# Altium schematic sheet MCU.SchDoc
size A4; SheetNumber: 5; SheetTotal: 9
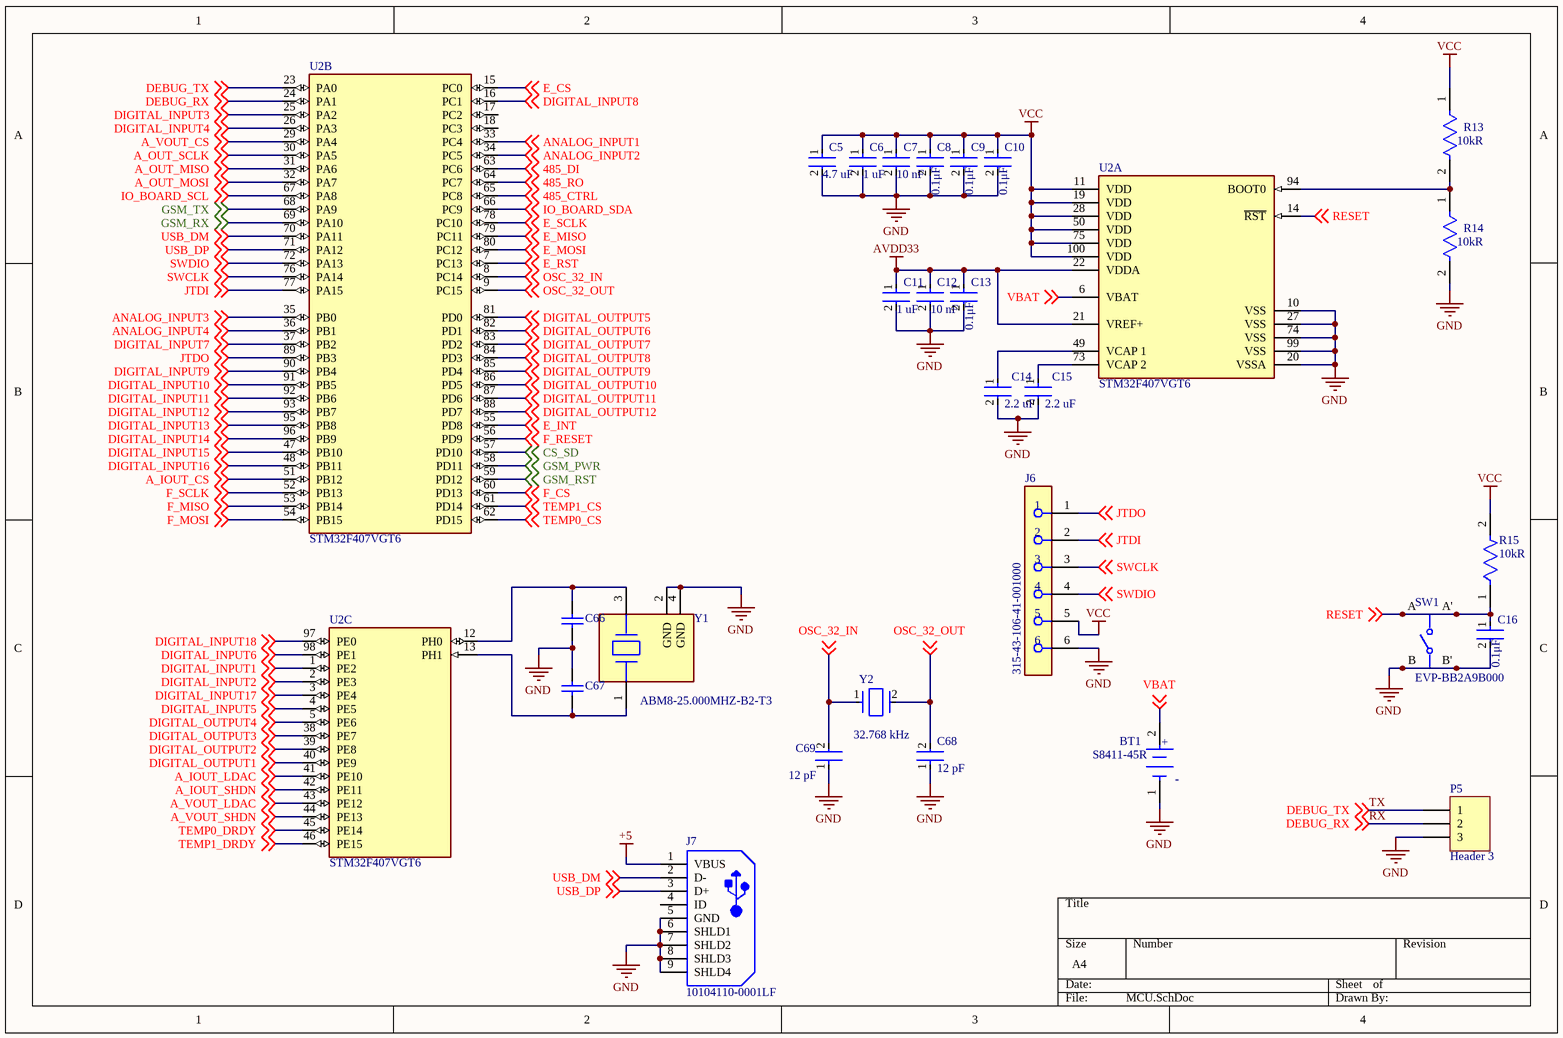
[diagram p0: MCU.SchDoc]

## Parts
BT1  S8411-45R  [FP-S8411-45R-MFG]
C5  value 4.7 uF  [FP-CC0603-DA-MFG]  (hidden comment: CC0603KRX5R8BB475)
C6  value 1 uF  [FP-CC0603-DA-MFG]  (hidden comment: CC0603KRX7R6BB105)
C7  value 10 nF  [FP-CC0603-DA-MFG]  (hidden comment: CC0603KRX7R6BB103)
C8  value 0.1μF  [FP-C0603C-CF-MFG]  (hidden comment: C0603C104K8PAC7867)
C9  value 0.1μF  [FP-C0603C-CF-MFG]  (hidden comment: C0603C104K8PAC7867)
C10  value 0.1μF  [FP-C0603C-CF-MFG]  (hidden comment: C0603C104K8PAC7867)
C11  value 1 uF  [FP-CC0603-DA-MFG]  (hidden comment: CC0603KRX7R6BB105)
C12  value 10 nF  [FP-CC0603-DA-MFG]  (hidden comment: CC0603KRX7R6BB103)
C13  value 0.1μF  [FP-C0603C-CF-MFG]  (hidden comment: C0603C104K8PAC7867)
C14  value 2.2 uF  [FP-CC0603-DA-MFG]  (hidden comment: CC0603KPX5R5BB225)
C15  value 2.2 uF  [FP-CC0603-DA-MFG]  (hidden comment: CC0603KPX5R5BB225)
C16  value 0.1μF  [FP-C0603C-CF-MFG]  (hidden comment: C0603C104K8PAC7867)
C66  VJ0603A180JXAAC  [CAPC1608X92X38ML15T08]  (value not drawn)
C67  VJ0603A180JXAAC  [CAPC1608X92X38ML15T08]  (value not drawn)
C68  value 12 pF  [FP-C0603C-CF-MFG]  (hidden comment: C0603C120C5GAC7867)
C69  value 12 pF  [FP-C0603C-CF-MFG]  (hidden comment: C0603C120C5GAC7867)
J6  315-43-106-41-001000  [FP-315-43-106-41-001000-MFG]
J7  10104110-0001LF  [FCI-10104110-0001LF_V]
P5  Header 3  [HDR1X3]
R13  Resistance: 10kR  [FP-CRCW0603-e3-IPC_A]  (hidden comment: CRCW060310K0FKED)
R14  Resistance: 10kR  [FP-CRCW0603-e3-IPC_A]  (hidden comment: CRCW060310K0FKED)
R15  Resistance: 10kR  [FP-CRCW0603-e3-IPC_A]  (hidden comment: CRCW060310K0FKED)
SW1  EVP-BB2A9B000  [FP-EVP-BB2A9B000-MFG]
U2  STM32F407VGT6  [FP-LQFP100-1L-IPC_A]  (parts A,B,C of 3)
Y1  ABM8-25.000MHZ-B2-T3  [FP-ABM8-MFG]
Y2  Operating Frequency: 32.768 kHz  [FP-ABS09-MFG]  (hidden comment: ABS09-32.768KHZ-1-T)

## Nets
+5: J7.1(VBUS)
AVDD33: C11.1 C12.1 C13.1 U2.21(VREF+) U2.22(VDDA)
GND: BT1.1(C) C5.2 C6.2 C7.2 C8.2 C9.2 C10.2 C11.2 C12.2 C13.2 C14.2 C15.2 C16.2 C66.2 C67.1 C68.1 C69.1 J6.6 J7.5(GND) J7.6(SHLD1) J7.7(SHLD2) J7.8(SHLD3) J7.9(SHLD4) P5.3 R14.2 SW1.B SW1.B' U2.10(VSS) U2.20(VSSA) U2.27(VSS) U2.74(VSS) U2.99(VSS) Y1.2(GND) Y1.4(GND)
VCC: C5.1 C6.1 C7.1 C8.1 C9.1 C10.1 J6.5 R13.1 R15.2 U2.11(VDD) U2.19(VDD) U2.28(VDD) U2.50(VDD) U2.75(VDD) U2.100(VDD)
485_CTRL: U2.65(PC8) ; off-sheet 485_CTRL
485_DI: U2.63(PC6) ; off-sheet 485_DI
485_RO: U2.64(PC7) ; off-sheet 485_RO
A_IOUT_CS: U2.51(PB12) ; off-sheet A_IOUT_CS
A_IOUT_LDAC: U2.41(PE10) ; off-sheet A_IOUT_LDAC
A_IOUT_SHDN: U2.42(PE11) ; off-sheet A_IOUT_SHDN
A_OUT_MISO: U2.31(PA6) ; off-sheet A_OUT_MISO
A_OUT_MOSI: U2.32(PA7) ; off-sheet A_OUT_MOSI
A_OUT_SCLK: U2.30(PA5) ; off-sheet A_OUT_SCLK
A_VOUT_CS: U2.29(PA4) ; off-sheet A_VOUT_CS
A_VOUT_LDAC: U2.43(PE12) ; off-sheet A_VOUT_LDAC
A_VOUT_SHDN: U2.44(PE13) ; off-sheet A_VOUT_SHDN
ANALOG_INPUT1: U2.33(PC4) ; off-sheet ANALOG_INPUT1
ANALOG_INPUT2: U2.34(PC5) ; off-sheet ANALOG_INPUT2
ANALOG_INPUT3: U2.35(PB0) ; off-sheet ANALOG_INPUT3
ANALOG_INPUT4: U2.36(PB1) ; off-sheet ANALOG_INPUT4
CS_SD: U2.57(PD10) ; off-sheet CS_SD
DIGITAL_INPUT1: U2.1(PE2) ; off-sheet DIGITAL_INPUT1
DIGITAL_INPUT2: U2.2(PE3) ; off-sheet DIGITAL_INPUT2
DIGITAL_INPUT3: U2.25(PA2) ; off-sheet DIGITAL_INPUT3
DIGITAL_INPUT4: U2.26(PA3) ; off-sheet DIGITAL_INPUT4
DIGITAL_INPUT5: U2.4(PE5) ; off-sheet DIGITAL_INPUT5
DIGITAL_INPUT6: U2.98(PE1) ; off-sheet DIGITAL_INPUT6
DIGITAL_INPUT7: U2.37(PB2) ; off-sheet DIGITAL_INPUT7
DIGITAL_INPUT8: U2.16(PC1) ; off-sheet DIGITAL_INPUT8
DIGITAL_INPUT9: U2.90(PB4) ; off-sheet DIGITAL_INPUT9
DIGITAL_INPUT10: U2.91(PB5) ; off-sheet DIGITAL_INPUT10
DIGITAL_INPUT11: U2.92(PB6) ; off-sheet DIGITAL_INPUT11
DIGITAL_INPUT12: U2.93(PB7) ; off-sheet DIGITAL_INPUT12
DIGITAL_INPUT13: U2.95(PB8) ; off-sheet DIGITAL_INPUT13
DIGITAL_INPUT14: U2.96(PB9) ; off-sheet DIGITAL_INPUT14
DIGITAL_INPUT15: U2.47(PB10) ; off-sheet DIGITAL_INPUT15
DIGITAL_INPUT16: U2.48(PB11) ; off-sheet DIGITAL_INPUT16
DIGITAL_INPUT17: U2.3(PE4) ; off-sheet DIGITAL_INPUT17
DIGITAL_INPUT18: U2.97(PE0) ; off-sheet DIGITAL_INPUT18
DIGITAL_OUTPUT1: U2.40(PE9) ; off-sheet DIGITAL_OUTPUT1
DIGITAL_OUTPUT2: U2.39(PE8) ; off-sheet DIGITAL_OUTPUT2
DIGITAL_OUTPUT3: U2.38(PE7) ; off-sheet DIGITAL_OUTPUT3
DIGITAL_OUTPUT4: U2.5(PE6) ; off-sheet DIGITAL_OUTPUT4
DIGITAL_OUTPUT5: U2.81(PD0) ; off-sheet DIGITAL_OUTPUT5
DIGITAL_OUTPUT6: U2.82(PD1) ; off-sheet DIGITAL_OUTPUT6
DIGITAL_OUTPUT7: U2.83(PD2) ; off-sheet DIGITAL_OUTPUT7
DIGITAL_OUTPUT8: U2.84(PD3) ; off-sheet DIGITAL_OUTPUT8
DIGITAL_OUTPUT9: U2.85(PD4) ; off-sheet DIGITAL_OUTPUT9
DIGITAL_OUTPUT10: U2.86(PD5) ; off-sheet DIGITAL_OUTPUT10
DIGITAL_OUTPUT11: U2.87(PD6) ; off-sheet DIGITAL_OUTPUT11
DIGITAL_OUTPUT12: U2.88(PD7) ; off-sheet DIGITAL_OUTPUT12
E_CS: U2.15(PC0) ; off-sheet E_CS
E_INT: U2.55(PD8) ; off-sheet E_INT
E_MISO: U2.79(PC11) ; off-sheet E_MISO
E_MOSI: U2.80(PC12) ; off-sheet E_MOSI
E_RST: U2.7(PC13) ; off-sheet E_RST
E_SCLK: U2.78(PC10) ; off-sheet E_SCLK
F_CS: U2.60(PD13) ; off-sheet F_CS
F_MISO: U2.53(PB14) ; off-sheet F_MISO
F_MOSI: U2.54(PB15) ; off-sheet F_MOSI
F_RESET: U2.56(PD9) ; off-sheet F_RESET
F_SCLK: U2.52(PB13) ; off-sheet F_SCLK
GSM_PWR: U2.58(PD11) ; off-sheet GSM_PWR
GSM_RST: U2.59(PD12) ; off-sheet GSM_RST
GSM_RX: U2.69(PA10) ; off-sheet GSM_RX
GSM_TX: U2.68(PA9) ; off-sheet GSM_TX
IO_BOARD_SCL: U2.67(PA8) ; off-sheet IO_BOARD_SCL
IO_BOARD_SDA: U2.66(PC9) ; off-sheet IO_BOARD_SDA
JTDI: J6.2 U2.77(PA15) ; off-sheet JTDI
JTDO: J6.1 U2.89(PB3) ; off-sheet JTDO
OSC_32_IN: C69.2 U2.8(PC14) Y2.1 ; off-sheet OSC_32_IN
OSC_32_OUT: C68.2 U2.9(PC15) Y2.2 ; off-sheet OSC_32_OUT
RESET: C16.1 R15.1 SW1.A SW1.A' U2.14(~{RST}) ; off-sheet RESET
RX: P5.2 U2.24(PA1) ; off-sheet DEBUG_RX  [also labelled DEBUG_RX]
SWCLK: J6.3 U2.76(PA14) ; off-sheet SWCLK
SWDIO: J6.4 U2.72(PA13) ; off-sheet SWDIO
TEMP0_CS: U2.62(PD15) ; off-sheet TEMP0_CS
TEMP0_DRDY: U2.45(PE14) ; off-sheet TEMP0_DRDY
TEMP1_CS: U2.61(PD14) ; off-sheet TEMP1_CS
TEMP1_DRDY: U2.46(PE15) ; off-sheet TEMP1_DRDY
TX: P5.1 U2.23(PA0) ; off-sheet DEBUG_TX  [also labelled DEBUG_TX]
USB_DM: J7.2(D-) U2.70(PA11) ; off-sheet USB_DM
USB_DP: J7.3(D+) U2.71(PA12) ; off-sheet USB_DP
VBAT: BT1.2(A) U2.6(VBAT) ; off-sheet VBAT
NetC14_1: C14.1 U2.49(VCAP_1)
NetC15_1: C15.1 U2.73(VCAP_2)
NetC66_1: C66.1 U2.12(PH0) Y1.3
NetC67_2: C67.2 U2.13(PH1) Y1.1
NetR13_2: R13.2 R14.1 U2.94(BOOT0)

Not connected (* = marked no-connect by the designer): J7 4(ID); U2 17(PC2) 18(PC3)

## Notes on the sheet
- (in symbol CMP-15817-000007-1) +; -

## Library data of the parts
BT1 = CMP-15817-000007-1: BATTERY HOLDER COIN 12MM SMD; Number of Batteries: 1; Material: Polyphenylene; Case/Package: SMD/SMT; Number of Cells: 1; Min Operating Temperature: -55°C; Termination: SMD/SMT; REACH SVHC: No SVHC; Contact Plating: Bronze; Package Quantity: 500; Max Operating Temperature: 105°C; Mount: Surface Mount; Packaging: Tape and Reel
C5 = CMP-03422-001217-1: CAP CER 4.7UF 25V X5R 0603; Manufacturer: YAGEO; Material: Ceramic; Temperature Coefficient: 15%; Tolerance: 0.1; Device Class L1: Passive Components; Temperature: -55°C to +125°C; RoHS: TRUE; Temperature Range High: +125°C; Automotive: No; Lead Free: Yes; Digikey Description: CAP CER 4.7UF 25V X5R 0603; Category: Cap; Temperature Characteristic: X5R; Manufacturer Part Number: CC0603KRX5R8BB475; Package: CC0603-DA; Device Class L2: Capacitors; Temperature Range Low: -55°C; Voltage Rating: 25 V; Capacitance: 4.7 uF; ComponentLink2URL: http://www.yageo.com/documents/recent/UPY-GPHC_X7R_6.3V-to-50V_18.pdf; Octopart: https://octopart.com/cc0603krx5r8bb475-yageo-77825350; Footprint Url: http://www.yageo.com/exep/pages/download/literatures/UPY-C_GEN_24.pdf; Device Class L3: Ceramic Capacitors; ComponentLink2Description: Datasheet; Voltage: 25 V; Height: 0.9mm
C6 C11 = CMP-03422-000835-1: CAP CER 1UF 10V X7R 0603; Manufacturer: YAGEO; Material: Ceramic; Temperature Coefficient: 15%; Tolerance: 0.1; Digikey Description: CAP CER 1UF 10V X7R 0603; Temperature: -55°C to +125°C; ComponentLink2URL: http://www.yageo.com/documents/recent/UPY-GPHC_X7R_6.3V-to-50V_18.pdf; Category: Cap; Voltage Rating: 10 V; Footprint Url: http://www.yageo.com/exep/pages/download/literatures/UPY-C_GEN_24.pdf; Mouser Description: Multilayer Ceramic Capacitors MLCC - SMD/SMT 1.0uF 10V X7R 10%; Device Class L3: Ceramic Capacitors; Temperature Characteristic: X7R; Automotive: No; Package: CC0603-DA; Temperature Range High: +125°C; Voltage: 10 V; Height: 0.9mm; Device Class L1: Passive Components; ComponentLink2Description: Datasheet; Lead Free: Yes; Octopart: https://octopart.com/cc0603krx7r6bb105-yageo-13184191; Capacitance: 1 uF; Manufacturer Part Number: CC0603KRX7R6BB105; Temperature Range Low: -55°C; RoHS: TRUE; Device Class L2: Capacitors
C7 C12 = CMP-03422-000575-1: CAP CER 10000PF 10V X7R 0603; Manufacturer: YAGEO; Tolerance: 0.1; Temperature Coefficient: 15%; Material: Ceramic; Footprint Url: http://www.yageo.com/exep/pages/download/literatures/UPY-C_GEN_24.pdf; Temperature Characteristic: X7R; Device Class L2: Capacitors; Voltage: 10 V; Octopart: https://octopart.com/cc0603krx7r6bb103-yageo-25629541; Height: 0.9mm; ComponentLink2Description: Datasheet; Manufacturer Part Number: CC0603KRX7R6BB103; Mouser Description: Cap Ceramic 0.01uF 10V X7R 10% SMD 0603 125°C Paper T/R; Voltage Rating: 10 V; Temperature Range High: +125°C; Temperature Range Low: -55°C; Capacitance: 10 nF; ComponentLink2URL: http://www.yageo.com/documents/recent/UPY-GPHC_X7R_6.3V-to-50V_18.pdf; RoHS: TRUE; Automotive: No; Device Class L1: Passive Components; Lead Free: Yes; Digikey Description: CAP CER 10000PF 10V X7R 0603; Package: CC0603-DA; Category: Cap; Temperature: -55°C to +125°C; Device Class L3: Ceramic Capacitors
C8-C10 C13 C16 = CMP-03020-019869-2: CAP CER SMD 0603 .1UF 10% X5R 10; Manufacturer: KEMET; Temperature Coefficient: 30ppm/°C; Automotive Grade: Grade 1; Tolerance: 0.1; Material: Ceramic; Voltage Rating: 10 V; Capacitance: 0.10 μF; Automotive: Yes; ComponentLink2Description: Datasheet; Device Class L2: Capacitors; ComponentLink2URL: https://api.kemet.com/component-edge/download/datasheet/C0603C100J5GACAUTO.pdf; Category: Cap; Lead Free: Yes; RoHS: TRUE; Device Class L3: Ceramic Capacitors; Device Class L1: Passive Components; Height: 0.87mm; Temperature Characteristic: X5R; Temperature Range Low: -55°C; Temperature Range High: +125°C; Digikey Description: CAP CER SMD 0603 .1UF 10% X5R 10; Octopart: https://octopart.com/c0603c104k8pac7867-kemet-90665683; Manufacturer Part Number: C0603C104K8PAC7867; Temperature: -55°C to +125°C; Package: C0603C-CF
C14 C15 = CMP-03422-000566-1: CC0603 2.2 uF X5R 10.00% 6.3 V; Manufacturer: YAGEO; Tolerance: 0.1; Material: Ceramic; Temperature Coefficient: 15%; Voltage Rating: 6.3 V; Manufacturer Part Number: CC0603KPX5R5BB225; Footprint Url: http://www.yageo.com/exep/pages/download/literatures/UPY-C_GEN_24.pdf; ComponentLink2Description: Datasheet; Device Class L2: Capacitors; Category: Cap; Lead Free: Yes; RoHS: TRUE; Package: CC0603-DA; Temperature Characteristic: X5R; Octopart: https://octopart.com/cc0603kpx5r5bb225-yageo-91091798; Height: 0.9mm; Temperature Range High: +125°C; Device Class L1: Passive Components; Temperature Range Low: -55°C; Automotive: No; Device Class L3: Ceramic Capacitors; Capacitance: 2.2 uF; Temperature: -55°C to +125°C; Voltage: 6.3 V; ComponentLink2URL: http://www.yageo.com/documents/recent/UPY-GPHC_X7R_6.3V-to-50V_18.pdf
C66 C67 = CMP-2006-01139-1: Manufacturer: Vitramon; Part Number: VJ0603A180JXAAC
C68 C69 = CMP-03020-011295-1: CAP CER 12PF 50V NP0 0603; Manufacturer: KEMET; Automotive Grade: Grade 1; Temperature Coefficient: 30ppm/°C; Tolerance: 0.25 pF; Material: Ceramic; Temperature Characteristic: C0G; Device Class L1: Passive Components; Category: Cap; Height: 0.87mm; Digikey Description: CAP CER 12PF 50V NP0 0603; Octopart: https://octopart.com/c0603c120c5gac7867-kemet-1583919; Temperature Range High: +125°C; Temperature Range Low: -55°C; Lead Free: Yes; Package: C0603C-CF; Automotive: Yes; Voltage Rating: 50 V; Temperature: -55°C to +125°C; Device Class L3: Ceramic Capacitors; ComponentLink2URL: https://api.kemet.com/component-edge/download/datasheet/C0603C100J5GACAUTO.pdf; Device Class L2: Capacitors; ComponentLink2Description: Datasheet; Capacitance: 12 pF; Manufacturer Part Number: C0603C120C5GAC7867; RoHS: TRUE
J6 = CMP-00254-12081839-1: 315-43-106-41-001000 IC & Component Sockets Interconnect Socket; Number of Positions: 6; Pitch: 2.54mm; Connector Type: Receptacle, Socket; Contact Plating: Gold; NexarPartId: 12081839; Mount: Through Hole; RoHS: Compliant; Termination: Solder; Packaging: Bulk; Color: Black; Number of Rows: 1
J7 = CMP-2000-05823-1: Micro USB, Receptacle, -55 to 85 degC, 5-Pin SMD, RoHS, Tape and Reel; Manufacturer: FCI Electronics; Connector Type: USBMicroB; Contact Termination: SurfaceMountRightAngle; Connector Mounting: PCB; No. of Contacts: 5; Manufacturer URL: http://portal.fciconnect.com/; Contact Plating: Gold; Package Description: 5-Pin Surface Mount Device, Body 8.06 x 5.6 mm, Pitch 0.65 mm; Datasheet URL: http://portal.fciconnect.com/Comergent//fci/drawing/10104110.pdf; Datasheet Version: Rev. C, 03/2011; Package Reference: 10104110-0001LF; Mounting Technology: SurfaceMount; Gender: Receptacle
P5 = Header 3: Header, 3-Pin; LatestRevisionDate: 17-Jul-2002; LatestRevisionNote: Re-released for DXP Platform.; Publisher: Altium Limited
R13-R15 = CMP-02407-003273-1: RES Thick Film, 10kΩ, 1%, 0.1W, 100ppm/°C, 0603; Max Power Dissipation: 100mW; Tolerance: 1%; Packaging: Tape and Reel; Lead Free: Lead Free; Max Operating Temperature: 155°C; Min Operating Temperature: -55°C; Package Quantity: 10000; Length: 0.061inch; Height: 0.02inch; Width: 0.033inch; Composition: Thick Film; Number of Terminations: 2; Case/Package: 0603; Features: Automotive AEC-Q200; Temperature Coefficient: 100ppm/°C
SW1 = CMP-05618-000013-1: SWITCH TACTILE SPST-NO 0.02A 15V; Manufacturer: Panasonic; Electromechanical Life: 500000Cycles; Contact Resistance: 500mΩ; Operating Force: 1.6N; Standoff Height: 0.025mm; Contact Current Rating: 20mA; Automotive: No; Digikey Description: SWITCH TACTILE SPST-NO 0.02A 15V; Octopart: https://octopart.com/evp-bb2a9b000-panasonic-75477754; Lead Free: Yes; Device Class L2: Switches; Temperature Range Low: -40°C; Temperature: -40°C to +85°C; Mount: Surface Mount; Temperature Range High: +85°C; Throw Configuration: SPST-NO; Device Class L1: Electromechanical; Height: 0.63mm; Manufacturer Part Number: EVP-BB2A9B000; Package: 0; ComponentLink2Description: Datasheet; Category: Switch; RoHS: TRUE; ComponentLink2URL: https://www3.panasonic.biz/ac/e_download/control/switch/light-touch/catalog/sw_lt_eng_2616s.pdf?f_cd=402266&via=ok; Voltage Rating Dc: 15V; Device Class L3: Tactile Switches
U2 = CMP-0243-00017-5: NexarPartId: 20570110; Manufacturer Package Identifier: 1L_ME_V5; Peripherals: Brown-out Detect/Reset, DMA, I2C, LCD, POR, PWM, WDT; Number of Programmable I/O: 82; Oscillator Type: Internal; Nominal Supply Current: 1.7µA; Number of Timers/Counters: 14; RAM Size: 192kB; Number of D/A Converters: 2; Number of Ethernet Channels: 1; Max Frequency: 168MHz; Number of SPI Channels: 3; Data Bus Width: 32b; Number of ADC Channels: 16; Max Supply Voltage: 3.6V; Number of USART Channels: 4; Interface: CAN, Ethernet, I2C, I2S, IrDA, LIN, SPI, UART, USART, USB; Max Junction Temperature (Tj): 125°C; Core Architecture: ARM Cortex-M4; Watchdog Timer: Yes; Memory Size: 1MB; Memory Type: FLASH; Min Supply Voltage: 1.8V; Number of I/Os: 82; Lead Free: Lead Free; Lifecycle Status: Production; Radiation Hardening: No; Frequency: 168MHz; Max Operating Temperature: 85°C; Height: 1.45mm; Number of Pins: 100; Number of I2C Channels: 3; Number of USB Channels: 1; REACH SVHC: No SVHC; Length: 14.2mm; Ambient Temperature Range High: 85°C; Schedule B: 8542310000, 8542310000; Number of Channels: 16; Number of A/D Converters: 3; Width: 14.2mm; Case/Package: LQFP; Flash Memory Size: 1MB; Min Operating Temperature: -40°C; Address Bus Width: 32b; Number of UART Channels: 2; RoHS: Compliant; Number of PWM Channels: 2
Y1 = CMP-27762-001275-1: Crystal 25MHz ±20ppm 18pF SMD-4 3.2mm x 2.5mm; ESR (Equivalent Series Resistance): 50R; Frequency Stability: 50ppm; Frequency Tolerance: 20ppm; Length: 0.126inch; Min Operating Temperature: -20°C; Width: 0.098inch; Series: ABM8; Load Capacitance: 18pF; Packaging: Tape and Reel; Case/Package: SMD/SMT; Max Operating Temperature: 70°C; Mount: Surface Mount; Height: 0.031inch; Frequency: 25MHz
Y2 = CMP-27762-005385-1: CRYSTAL 32.7680KHZ 12.5PF SMD; ESR (Equivalent Series Resistance): 70kR; Tolerance: 10ppm; Package Quantity: 3000; Lead Free: Lead Free; Frequency: 32.768kHz; Load Capacitance: 12.5pF; Series Resistance: 70kR; Series: ABS09; Min Operating Temperature: -40°C; Frequency Tolerance: 10ppm; Packaging: Tape and Reel; Termination: SMD/SMT; RoHS Compliant: Yes; Width: 1.5mm; Number of Pins: 2; Case/Package: CSMD; Mount: Surface Mount; Height: 0.035inch; Length: 4.1mm; Depth: 1.5mm; Max Operating Temperature: 85°C